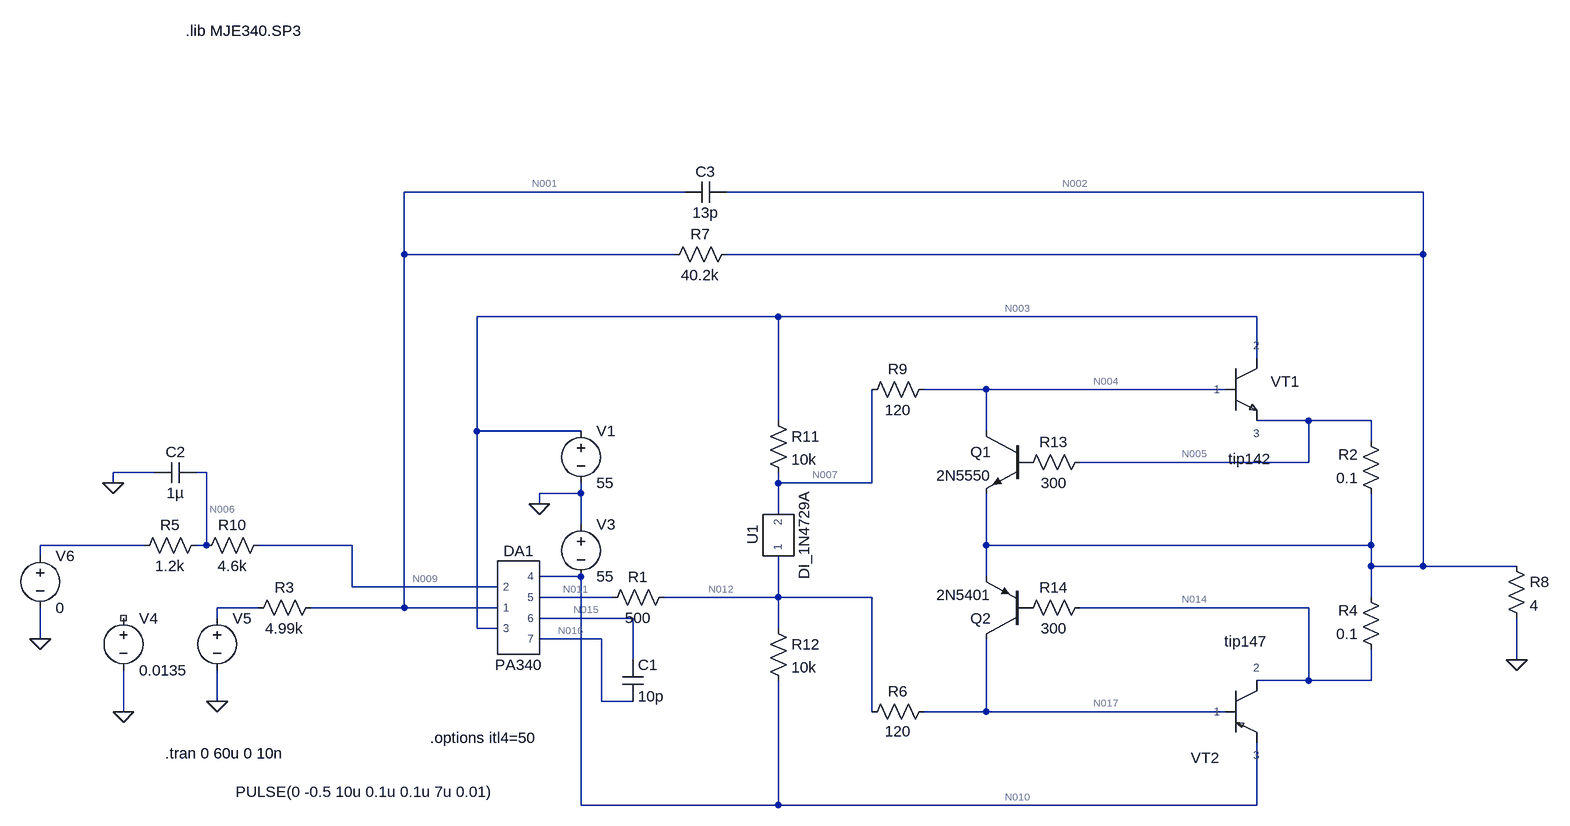
[diagram p0: schematic Draft15.asc]
Draft15.asc, the LTspice schematic file:
Version 4
SHEET 1 2072 1016
WIRE 448 -480 16 -480
WIRE 1584 -480 512 -480
WIRE 16 -384 16 -480
WIRE 432 -384 16 -384
WIRE 1584 -384 1584 -480
WIRE 1584 -384 512 -384
WIRE 592 -288 128 -288
WIRE 1328 -288 592 -288
WIRE 1328 -224 1328 -288
WIRE 912 -176 816 -176
WIRE 1280 -176 912 -176
WIRE 592 -128 592 -288
WIRE 1408 -128 1328 -128
WIRE 1504 -128 1408 -128
WIRE 128 -112 128 -288
WIRE 288 -112 128 -112
WIRE 912 -112 912 -176
WIRE 1504 -96 1504 -128
WIRE 1408 -64 1408 -128
WIRE 1408 -64 1056 -64
WIRE -368 -48 -432 -48
WIRE -288 -48 -304 -48
WIRE -432 -32 -432 -48
WIRE 592 -32 592 -48
WIRE 736 -32 736 -176
WIRE 736 -32 592 -32
WIRE 288 -16 288 -32
WIRE 288 -16 224 -16
WIRE 224 0 224 -16
WIRE 592 16 592 -32
WIRE 288 32 288 -16
WIRE -384 64 -544 64
WIRE -288 64 -288 -48
WIRE -288 64 -304 64
WIRE -64 64 -208 64
WIRE 912 64 912 -16
WIRE 1504 64 1504 -16
WIRE 1504 64 912 64
WIRE -544 80 -544 64
WIRE 1504 96 1504 64
WIRE 1584 96 1584 -384
WIRE 1584 96 1504 96
WIRE 1728 96 1584 96
WIRE 288 112 224 112
WIRE 912 112 912 64
WIRE -64 128 -64 64
WIRE 160 128 -64 128
WIRE 336 144 224 144
WIRE 592 144 592 80
WIRE 592 144 416 144
WIRE 736 144 592 144
WIRE 1504 144 1504 96
WIRE -208 160 -272 160
WIRE 16 160 16 -384
WIRE 16 160 -128 160
WIRE 160 160 16 160
WIRE 1408 160 1056 160
WIRE -272 176 -272 160
WIRE 368 176 224 176
WIRE 128 192 128 -112
WIRE 160 192 128 192
WIRE 592 192 592 144
WIRE -544 208 -544 160
WIRE 320 208 224 208
WIRE 368 240 368 176
WIRE 1728 240 1728 176
WIRE 1408 272 1408 160
WIRE 1408 272 1328 272
WIRE 1504 272 1504 224
WIRE 1504 272 1408 272
WIRE -272 304 -272 256
WIRE 320 304 320 208
WIRE 368 304 320 304
WIRE -416 320 -416 256
WIRE 736 320 736 144
WIRE 912 320 912 208
WIRE 912 320 816 320
WIRE 1280 320 912 320
WIRE 288 464 288 112
WIRE 592 464 592 272
WIRE 592 464 288 464
WIRE 1328 464 1328 368
WIRE 1328 464 592 464
FLAG -416 320 0
FLAG 1728 240 0
FLAG -272 304 0
FLAG -432 -32 0
FLAG -544 208 0
FLAG 224 0 0
SYMBOL PA340 192 160 R0
SYMATTR InstName DA1
SYMBOL res -112 144 R90
WINDOW 0 0 56 VBottom 2
WINDOW 3 32 56 VTop 2
SYMATTR InstName R3
SYMATTR Value 4.99k
SYMBOL cap 352 240 R0
SYMATTR InstName C1
SYMATTR Value 10p
SYMBOL res 1712 80 R0
SYMATTR InstName R8
SYMATTR Value 4
SYMBOL res -192 48 R90
WINDOW 0 0 56 VBottom 2
WINDOW 3 32 56 VTop 2
SYMATTR InstName R10
SYMATTR Value 4.6k
SYMBOL voltage -272 160 R0
WINDOW 123 0 0 Left 0
WINDOW 39 0 0 Left 0
WINDOW 3 29 283 Left 2
SYMATTR Value PULSE(0 -0.5 10u 0.1u 0.1u 7u 0.01)
SYMATTR InstName V5
SYMBOL res 832 304 R90
WINDOW 0 0 56 VBottom 2
WINDOW 3 62 56 VBottom 2
SYMATTR InstName R6
SYMATTR Value 120
SYMBOL voltage -416 160 R0
WINDOW 123 0 0 Left 0
WINDOW 39 0 0 Left 0
SYMATTR InstName V4
SYMATTR Value 0.0135
SYMBOL tip142 1312 -176 R0
WINDOW 0 60 3 Bottom 2
WINDOW 3 5 91 Top 2
SYMATTR InstName VT1
SYMBOL tip147 1312 320 M180
WINDOW 0 -63 -55 Bottom 2
WINDOW 3 -1 93 Top 2
SYMATTR InstName VT2
SYMBOL res -288 48 R90
WINDOW 0 0 56 VBottom 2
WINDOW 3 32 56 VTop 2
SYMATTR InstName R5
SYMATTR Value 1.2k
SYMBOL cap -304 -64 R90
WINDOW 0 0 32 VBottom 2
WINDOW 3 32 32 VTop 2
SYMATTR InstName C2
SYMATTR Value 1µ
SYMBOL voltage -544 64 R0
WINDOW 123 0 0 Left 0
WINDOW 39 0 0 Left 0
SYMATTR InstName V6
SYMATTR Value 0
SYMBOL res 528 -400 R90
WINDOW 0 0 56 VBottom 2
WINDOW 3 32 56 VTop 2
SYMATTR InstName R7
SYMATTR Value 40.2k
SYMBOL res 832 -192 R90
WINDOW 0 0 56 VBottom 2
WINDOW 3 32 56 VTop 2
SYMATTR InstName R9
SYMATTR Value 120
SYMBOL cap 512 -496 R90
WINDOW 0 0 32 VBottom 2
WINDOW 3 32 32 VTop 2
SYMATTR InstName C3
SYMATTR Value 13p
SYMBOL voltage 288 16 R0
WINDOW 123 0 0 Left 0
WINDOW 39 0 0 Left 0
SYMATTR InstName V3
SYMATTR Value 55
SYMBOL voltage 288 -128 R0
WINDOW 123 0 0 Left 0
WINDOW 39 0 0 Left 0
SYMATTR InstName V1
SYMATTR Value 55
SYMBOL res 432 128 R90
WINDOW 0 0 56 VBottom 2
WINDOW 3 32 56 VTop 2
SYMATTR InstName R1
SYMATTR Value 500
SYMBOL res 1520 0 R180
WINDOW 0 36 76 Left 2
WINDOW 3 36 40 Left 2
SYMATTR InstName R2
SYMATTR Value 0.1
SYMBOL res 1520 240 R180
WINDOW 0 36 76 Left 2
WINDOW 3 36 40 Left 2
SYMATTR InstName R4
SYMATTR Value 0.1
SYMBOL res 576 -144 R0
SYMATTR InstName R11
SYMATTR Value 10k
SYMBOL res 576 176 R0
SYMATTR InstName R12
SYMATTR Value 10k
SYMBOL 1N4729A 592 48 R270
SYMATTR InstName U1
SYMBOL npn 976 -112 M0
SYMATTR InstName Q1
SYMATTR Value 2N5550
SYMBOL pnp 976 208 R180
SYMATTR InstName Q2
SYMATTR Value 2N5401
SYMBOL res 1072 -80 R90
WINDOW 0 0 56 VBottom 2
WINDOW 3 32 56 VTop 2
SYMATTR InstName R13
SYMATTR Value 300
SYMBOL res 1072 144 R90
WINDOW 0 0 56 VBottom 2
WINDOW 3 32 56 VTop 2
SYMATTR InstName R14
SYMATTR Value 300
TEXT -352 384 Left 2 !.tran 0 60u 0 10n
TEXT 56 360 Left 2 !.options itl4=50
TEXT -320 -728 Left 2 !.lib MJE340.SP3

The netlist it stands for:
* Draft15.asc
XDA1 N009 N001 N003 N010 N011 N015 N016 PA340  ; pins 2 1 3 4 5 6 7
R3 N001 N013 4.99k
C1 N015 N016 10p
R8 N002 0 4
R10 N009 N006 4.6k
V5 N013 0 PULSE(0 -0.5 10u 0.1u 0.1u 7u 0.01)
R6 N017 N012 120
V4 NC_01 0 0.0135
XVT1 N003 N004 N005 tip142  ; pins 2 1 3
XVT2 N010 N017 N014 tip147  ; pins 3 1 2
R5 N006 N008 1.2k
C2 N006 0 1µ
V6 N008 0 0
R7 N002 N001 40.2k
R9 N004 N007 120
C3 N002 N001 13p
V3 0 N010 55
V1 N003 0 55
R1 N012 N011 500
R2 N002 N005 0.1
R4 N014 N002 0.1
R11 N003 N007 10k
R12 N012 N010 10k
XU1 N012 N007 DI_1N4729A  ; pins 1 2
Q1 N004 P001 N002 0 2N5550
Q2 N017 P002 N002 0 2N5401
R13 N005 P001 300
R14 N014 P002 300
.model NPN NPN
.model PNP PNP
.lib standard.bjt
.tran 0 60u 0 10n
.options itl4=50
.lib MJE340.SP3
.lib PA340_Pspice.LIB
.lib TIP142.cir
.lib TIP147.cir
.lib D:\1-LTspise\BASE_MOSFET\1N4729A.cir
.backanno
.end

* Results of the author's LTspice run, read from the files saved beside the schematic
* Operating Point, zero values left out:
*   V(n003) = 55 V
*   V(n010) = -55 V
*   V(n015) = 836.9 µV
*   V(n016) = -1.046 V
*   V(n011) = -1.079 V
*   V(n001) = 12.05 mV
*   V(n009) = -319 nV
*   V(n002) = 109.1 mV
*   V(n006) = -66 nV
*   V(n017) = -1.244 V
*   V(n012) = -1.265 V
*   V(n004) = 2.005 V
*   V(n005) = 113.1 mV
*   V(n014) = 107.9 mV
*   V(n007) = 2.062 V
*   V(p001) = 113.1 mV
*   V(p002) = 107.9 mV
*   Ic(Q2) = -1.38 pA
*   Ib(Q2) = 1.356 pA
*   Ic(Q1) = 1.896 pA
*   Ib(Q1) = -1.889 pA
*   I(R14) = 1.356 pA
*   I(R13) = -1.889 pA
*   I(R12) = 5.373 mA
*   I(R11) = 5.294 mA
*   I(R4) = -12.17 mA
*   I(R2) = -39.46 mA
*   I(R1) = -373.3 µA
*   I(R9) = -473.4 µA
*   I(R7) = 2.415 µA
*   I(R5) = -55 pA
*   I(R6) = 179.8 µA
*   I(R10) = -55 pA
*   I(R8) = 27.28 mA
*   I(R3) = 2.415 µA
*   I(V1) = -46.66 mA
*   I(V3) = -19.37 mA
*   I(V6) = -55 pA
*   I(V5) = 2.415 µA
*   Ix(da1:2) = 55 pA
*   Ix(da1:1) = 50 pA
*   Ix(da1:3) = 2.376 mA
*   Ix(da1:4) = -2.003 mA
*   Ix(da1:5) = -373.3 µA
*   Ix(vt1:1) = 38.99 mA
*   Ix(vt1:2) = 473.4 µA
*   Ix(vt1:3) = -39.46 mA
*   Ix(vt2:1) = -12 mA
*   Ix(vt2:2) = -179.8 µA
*   Ix(vt2:3) = 12.17 mA
*   Ix(u1:1) = -4.82 mA
*   Ix(u1:2) = 4.82 mA
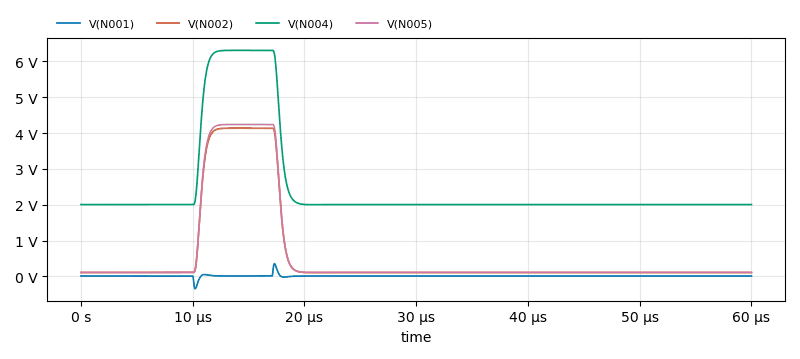
[diagram p1: Transient Analysis of Draft15.asc, plotted from the saved traces]
* Transient Analysis, 1 run:
*   V(N001): min -345.1 mV, max 357.8 mV, average 12.04 mV, rms 35.85 mV, last 12.05 mV
*   V(N002): min 107.8 mV, max 4.137 V, average 585.7 mV, rms 1.383 V, last 109.1 mV
*   V(N004): min 2.004 V, max 6.309 V, average 2.517 V, rms 2.851 V, last 2.005 V
*   V(N005): min 111.8 mV, max 4.241 V, average 601.5 mV, rms 1.418 V, last 113.1 mV